# Altium schematic sheet MPPT.SchDoc
size A3; SheetNumber: 1; SheetTotal: 1
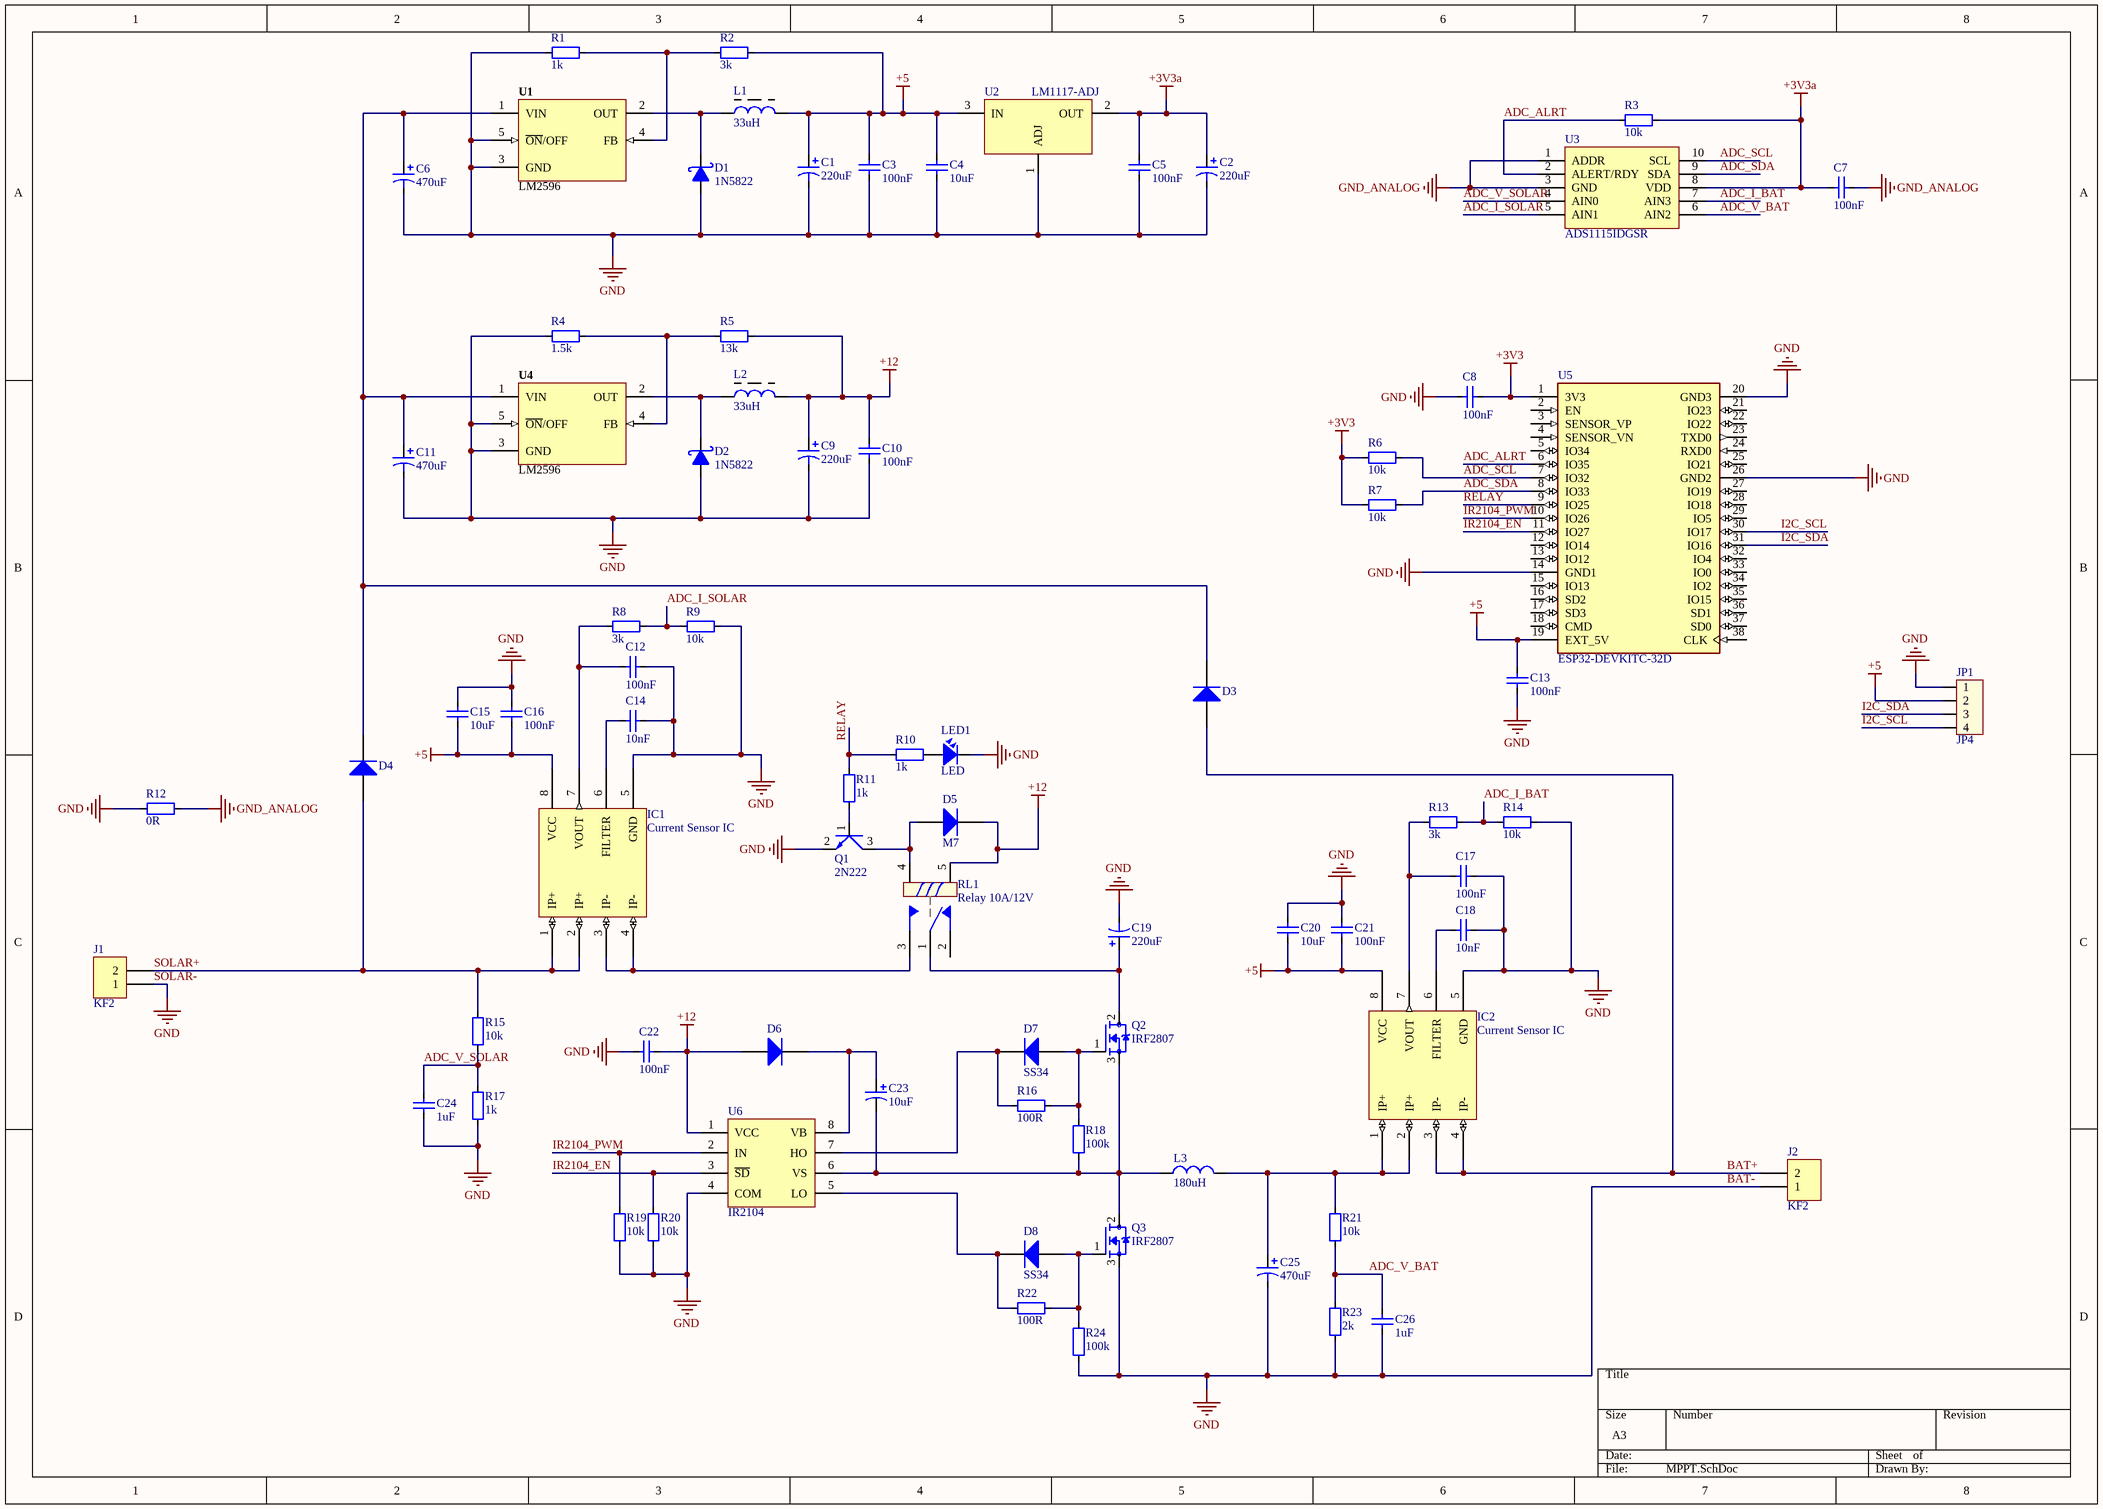
[diagram p0: MPPT.SchDoc]

## Parts
C1  220uF  [C5mm]
C2  220uF  [C5mm]
C3  100nF  [CAP_0805]
C4  10uF  [CAP_0805]
C5  100nF  [CAP_0805]
C6  470uF  [C8mm]
C7  100nF  [CAP_0805]
C8  100nF  [CAP_0805]
C9  220uF  [C5mm]
C10  100nF  [CAP_0805]
C11  470uF  [C8mm]
C12  100nF  [CAP_0805]
C13  100nF  [CAP_0805]
C14  10nF  [CAP_0805]
C15  10uF  [CAP_0805]
C16  100nF  [CAP_0805]
C17  100nF  [CAP_0805]
C18  10nF  [CAP_0805]
C19  220uF  [C8mm]
C20  10uF  [CAP_0805]
C21  100nF  [CAP_0805]
C22  100nF  [CAP_0805]
C23  10uF  [CAP_7343]
C24  1uF  [CAP_0805]
C25  470uF  [C8mm]
C26  1uF  [CAP_0805]
D1  1N5822  [SMA]
D2  1N5822  [SMA]
D3  SS34 Diode 3A 40V  [DIODE SMA]  (value not drawn)
D4  SS34 Diode 3A 40V  [DIODE SMA]  (value not drawn)
D5  M7  [DIODE SMA]
D6  SS34 Diode 3A 40V  [DIODE SMA]  (value not drawn)
D7  SS34  [DIODE SMA]
D8  SS34  [DIODE SMA]
IC1  Current Sensor IC  [SOIC-8]
IC2  Current Sensor IC  [SOIC-8]
J1  KF2  [KF2-5.08]
J2  KF2  [KF2-5.08]
JP1  JP4  [CON4]
L1  33uH  [L-SMD-12x12]
L2  33uH  [L-SMD-12x12]
L3  180uH  [L-DIP-M-13.5x6]
LED1  LED  [LED-0805-Red]
Q1  2N222  [SOT23D]
Q2  IRF2807  [IRF2807]
Q3  IRF2807  [IRF2807]
R1  1k  [RES-SMD-0805]
R2  3k  [RES-SMD-0805]
R3  10k  [RES-SMD-0805]
R4  1.5k  [RES-SMD-0805]
R5  13k  [RES-SMD-0805]
R6  10k  [RES-SMD-0805]
R7  10k  [RES-SMD-0805]
R8  3k  [RES-SMD-0805]
R9  10k  [RES-SMD-0805]
R10  1k  [RES-SMD-0805]
R11  1k  [RES-SMD-0805]
R12  0R  [RES-SMD-1206]
R13  3k  [RES-SMD-0805]
R14  10k  [RES-SMD-0805]
R15  10k  [RES-SMD-0805]
R16  100R  [RES-SMD-0805]
R17  1k  [RES-SMD-0805]
R18  100k  [RES-SMD-0805]
R19  10k  [RES-SMD-0805]
R20  10k  [RES-SMD-0805]
R21  10k  [RES-SMD-0805]
R22  100R  [RES-SMD-0805]
R23  2k  [RES-SMD-0805]
R24  100k  [RES-SMD-0805]
RL1  Relay 10A/12V  [RELAY 5]
U1  LM2596  [TO263]
U2  LM1117-ADJ  [LM1117-SOP]
U3  ADS1115IDGSR  [VSOP-10_19.6_230_57X12_SMD]
U4  LM2596  [TO263]
U5  ESP32-DEVKITC-32D  [MODULE_ESP32-DEVKITC-32D]
U6  IR2104  [SO-8N]

## Nets
+3V3: C8.2 R6.1 R7.1 U5.1(3V3)
+3V3a: C2.1 C5.1 C7.1 R3.1 U2.2(OUT) U3.8(VDD)
+5: C1.1 C3.1 C4.1 C13.2 C15.1 C16.1 C20.1 C21.1 IC1.8(VCC) IC2.8(VCC) JP1.2 L1.2 R2.2 U2.3(IN) U5.19(EXT_5V)
+12: C9.1 C10.1 C22.1 D5.2(K) D6.1(A) L2.2 R5.2 RL1.5 U6.1(VCC)
BAT-: C1.2 C2.2 C3.2 C4.2 C5.2 C6.2 C8.1 C9.2 C10.2 C11.2 C12.2 C13.1 C14.2 C15.2 C16.2 C17.2 C18.2 C19.2 C20.2 C21.2 C22.2 C24.2 C25.2 C26.2 D1.1(A) D2.1(A) IC1.5(GND) IC2.5(GND) J1.1 J2.1 JP1.1 LED1.2 Q1.2(E) Q3.3(S) R1.1 R4.1 R9.1 R12.2 R14.1 R17.2 R19.1 R20.1 R23.2 R24.2 U1.3(GND) U1.5(~{ON}/OFF) U2.1(ADJ) U4.3(GND) U4.5(~{ON}/OFF) U5.14(GND1) U5.20(GND3) U5.26(GND2) U6.4(COM)  [also labelled GND, SOLAR-]
GND_ANALOG: C7.2 R12.1 U3.1(ADDR) U3.3(GND)
ADC_ALRT: R3.2 U3.2(ALERT/RDY) U5.6(IO35)
ADC_I_BAT: R13.1 R14.2 U3.7(AIN3)
ADC_I_SOLAR: R8.1 R9.2 U3.5(AIN1)
ADC_SCL: R6.2 U3.10(SCL) U5.7(IO32)
ADC_SDA: R7.2 U3.9(SDA) U5.8(IO33)
ADC_V_BAT: C26.1 R21.2 R23.1 U3.6(AIN2)
ADC_V_SOLAR: C24.1 R15.1 R17.1 U3.4(AIN0)
BAT+: D3.1(A) IC2.3(IP-) IC2.4(IP-) J2.2
I2C_SCL: JP1.4 U5.30(IO17)
I2C_SDA: JP1.3 U5.31(IO16)
IR2104_EN: R20.2 U5.11(IO27) U6.3(~{SD})
IR2104_PWM: R19.2 U5.10(IO26) U6.2(IN)
RELAY: R10.2 R11.2 U5.9(IO25)
SOLAR+: D4.1(A) IC1.1(IP+) IC1.2(IP+) J1.2 R15.2
NetC6_1: C6.1 C11.1 D3.2(K) D4.2(K) U1.1(VIN) U4.1(VIN)
NetC12_1: C12.1 IC1.7(VOUT) R8.2
NetC14_1: C14.1 IC1.6(FILTER)
NetC17_1: C17.1 IC2.7(VOUT) R13.2
NetC18_1: C18.1 IC2.6(FILTER)
NetC19_1: C19.1 Q2.2(D) RL1.1
NetC23_1: C23.1 D6.2(K) U6.8(VB)
NetC23_2: C23.2 L3.1 Q2.3(S) Q3.2(D) R18.2 U6.6(VS)
NetC25_1: C25.1 IC2.1(IP+) IC2.2(IP+) L3.2 R21.1
NetD1_2: D1.2(K) L1.1 U1.2(OUT)
NetD2_2: D2.2(K) L2.1 U4.2(OUT)
NetD5_1: D5.1(A) Q1.3(C) RL1.4
NetD7_1: D7.1(A) Q2.1(G) R16.1 R18.1
NetD7_2: D7.2(K) R16.2 U6.7(HO)
NetD8_1: D8.1(A) Q3.1(G) R22.1 R24.1
NetD8_2: D8.2(K) R22.2 U6.5(LO)
NetIC1_3: IC1.3(IP-) IC1.4(IP-) RL1.3
NetLED1_1: LED1.1 R10.1
NetQ1_1: Q1.1(B) R11.1
NetR1_2: R1.2 R2.1 U1.4(FB)
NetR4_2: R4.2 R5.1 U4.4(FB)

Not connected (* = marked no-connect by the designer): RL1 2; U5 2(EN) 3(SENSOR_VP) 4(SENSOR_VN) 5(IO34) 12(IO14) 13(IO12) 15(IO13) 16(SD2) 17(SD3) 18(CMD) 21(IO23) 22(IO22) 23(TXD0) 24(RXD0) 25(IO21) 27(IO19) 28(IO18) 29(IO5) 32(IO4) 33(IO0) 34(IO2) 35(IO15) 36(SD1) 37(SD0) 38(CLK)

## Library data of the parts
C1 C2 C9 = Cap Pol: 220uF 25V 6x7mm; Published: 8-Jun-2000; LatestRevisionDate: 17-Jul-2002; LatestRevisionNote: Re-released for DXP Platform.; PackageReference: POLAR0.8; Publisher: Altium Limited
C3-C5 C7 C8 C10 C12-C18 C20-C22 C24 C26 = CapSMD: Capacitor; Value: 33p; Published: 8-Jun-2000; LatestRevisionDate: 17-Jul-2002; LatestRevisionNote: Re-released for DXP Platform.; PackageReference: RAD-0.3; Publisher: Altium Limited
C6 C11 C19 = Cap Pol: 220uF 50V 8x12mm; Published: 8-Jun-2000; LatestRevisionDate: 17-Jul-2002; LatestRevisionNote: Re-released for DXP Platform.; PackageReference: POLAR0.8; Publisher: Altium Limited
C23 = CAP_TAN_SMD: 10uF 35V SMD7343
C25 = Cap Pol: 470uF 50V 8x12mm; Published: 8-Jun-2000; LatestRevisionDate: 17-Jul-2002; LatestRevisionNote: Re-released for DXP Platform.; PackageReference: POLAR0.8; Publisher: Altium Limited
D1 D2 = 1N5822: Schottky Rectifiers; Value: Diode c?m 1N5408
D3-D5 = Diode M7 ( 4007 ): Dán; Don_Vi: Con; Ten_Linh_Kien: Diode M7 1N4007 SMD 1A 1000V; Ma_Hang: MH000944; Chung_Loai: Dán; Ghi_Chu: *
D6-D8 = Diode SS34 ( 1N5822 ): Dán; Don_Vi: Con; Ma_Hang: MH002104; Ten_Linh_Kien: Diode SS34 3A 40V SMA ( 1N5822 SS34A); Kieu_Chan: *; Chung_Loai: Dán
IC1 IC2 = ACS712
J1 J2 = KF2: Manufacturer: Würth Elektronik eiSos GmbH; partNo: 691103110002; ComponentLink1 Description: Manufacturer; ComponentLink2 Description: Datasheet; NoPins: 2; Created Date: 29 October 2013; ComponentLink1URL: http://www.we-online.com; ComponentLink2URL: http://katalog.we-online.de/em/datasheet/6911031100xx.pdf; Created by: Karrer Zheng
JP1 = Con4: Connector 4; Value: Connector 4
L1 L2 = Inductor Ferit: 33uH CD127 3A 12x12x7mm; Value: 150 mH
L3 = Inductor: 180uH 4A 13mm; Value: 150 mH
LED1 = LED: LED Single colour Green and Red; Value: LED 3 ly Single Colour
Q1 = 2N222: NPN 600mW, ECB; Value: C1815
R1-R24 = Resistor - SMD: Resistor; Manufacturer: Generic Components; Class: Passive; Published: 08/06/2000; Publisher: Altium Hobart Technology Centre
RL1 = Relay 5: Relay SPDT,10A - 12VDC 5 Pin; Value: Relay SPDT, 10A, 12V
U1 U4 = LM2596: Max Input Voltage: 12 V; Max Output Current: 3 (6.0 peak) A; Max Output Voltage: mV; Category: IC-Power; Min Input Voltage: mV; Min Output Voltage: mV; Mounting Technology: Surface Mount; Status: Unreleased; Supply Voltage: mV; Temperature Range: -40 to +125 degC
U2 = LM1117-ADJ: 800mA Low-Dropout Linear Regulator; Creator: Nguyen Ba Bien; Website: http://group3i.net
U3 = IC_ADS1115IDGSR: Analog to Digital Converters - ADC 16B ADC w/ Int MUX PGA Comp Osc & Ref; Manufacturer: Texas Instruments; Alternate Part Number-1: NA; Manufacturer Part Number: ADS1115IDGSR; Case/Package: MSOP-10; Supplier-1: Mouser; Supplier Part Number-1: 595-ADS1115IDGSR
U5 = ESP32-DEVKITC-32D: EVAL BOARD FOR ESP-WROOM-32; MF: Espressif Systems; Value: *; MP: ESP32-DEVKITC-32D; Price: None; Check_prices: https://www.snapeda.com/parts/ESP32-DEVKITC-32D/Espressif%20Systems/view-part/2777395/?ref=eda; SnapEDA_Link: https://www.snapeda.com/parts/ESP32-DEVKITC-32D/Espressif%20Systems/view-part/2777395/?ref=snap; Availability: Warning; Purchase-URL: https://pricing.snapeda.com/search/part/ESP32-DEVKITC-32D/?ref=eda; Package: None
U6 = IR2184: Half-Bridge Driver